# EAGLE design C12880-vertical (EAGLE 7.7.0)
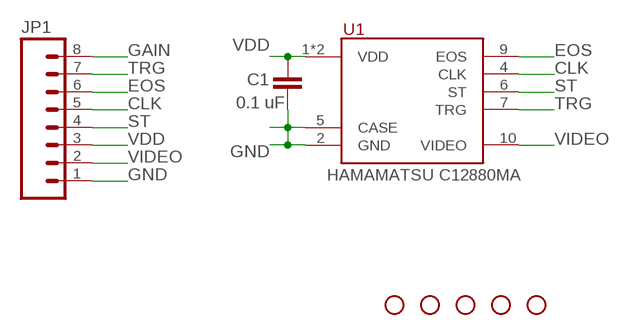
[diagram p0: schematic, sheet 1]

## Parts
C1  0.1 uF  C-EUC0805  [C0805]
JP1  M08SILK_FEMALE_PTH  [1X08]
STANDOFF1  STAND-OFF  [STAND-OFF]
STANDOFF2  STAND-OFF  [STAND-OFF]
STANDOFF3  STAND-OFF  [STAND-OFF]
STANDOFF4  STAND-OFF  [STAND-OFF]
STANDOFF5  STAND-OFF  [STAND-OFF]
U1  MICROSPEC-C12880MA  [C12880MA]

## Nets
CLK: JP1.5 U1.4(CLK)
EOS: JP1.6 U1.9(EOS)
GAIN: JP1.8
GND: C1.2 JP1.1 U1.2(GND) U1.5(CASE)
ST: JP1.4 U1.6(ST)
TRG: JP1.7 U1.7(TRG)
VDD: C1.1 JP1.3 U1.1(VDD) U1.3(VDD)
VIDEO: JP1.2 U1.10(VIDEO)

## Library data of the parts
C1 = Spectron2:C-EU: CAPACITOR, European symbol
JP1 = Spectron2:M08: Header 8 Standard 8-pin 0.1" header. Use with straight break away headers (SKU : PRT-00116), right angle break away headers (PRT-00553), swiss pins (PRT-00743), machine pins (PRT-00117), and female headers (PRT-00115).; PROD_ID: CONN-08438
STANDOFF1-STANDOFF5 = Spectron2:STAND-OFF: #4 Stand Off This is the mechanical footprint for a #4 phillips button head screw. Use the keepout ring to avoid running the screw head into surrounding components. SKU : PRT-00447
U1 = C12880MA:MICROSPEC-C12880MA: Hamamatsu Micro-Spectrometer C12666MA 350-750nm

## Board
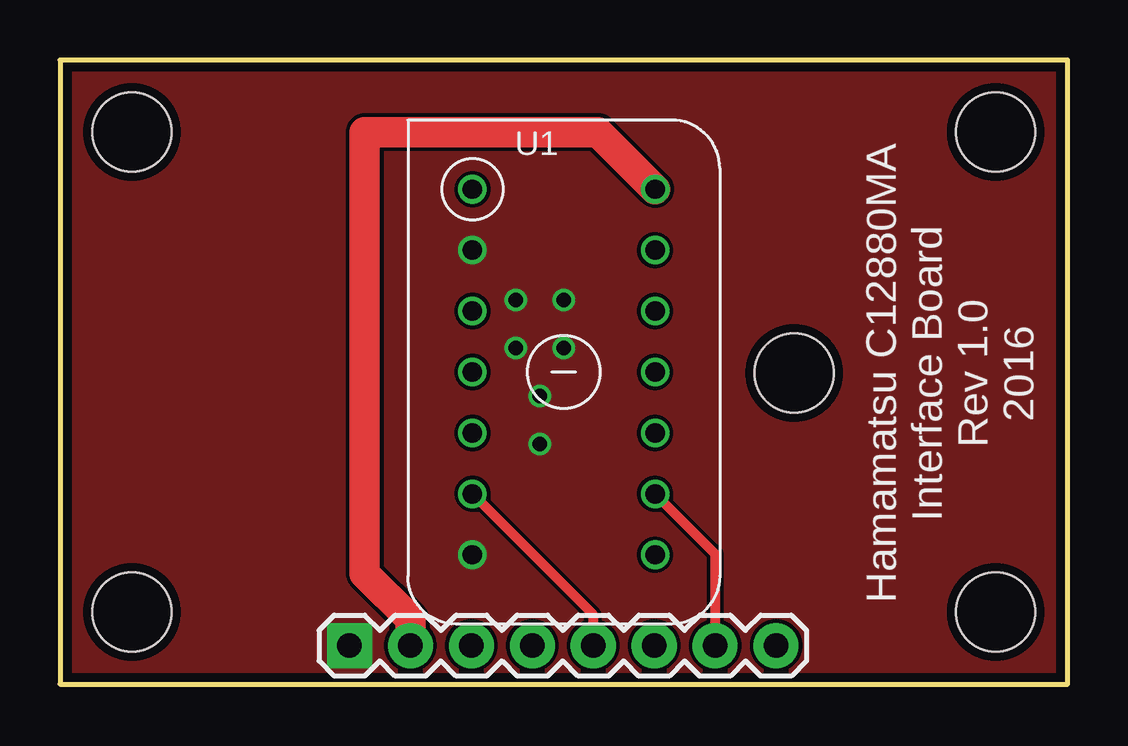
[diagram p1: board, top side]
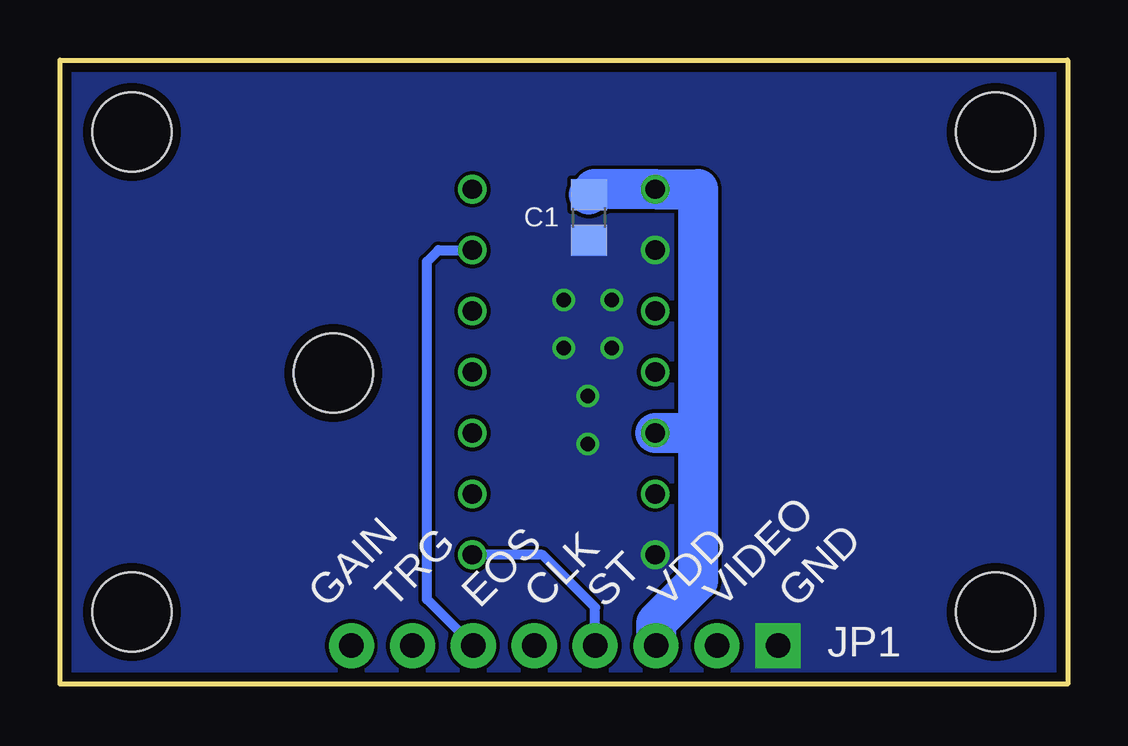
[diagram p2: board, bottom side, seen from below]

Size 42 x 26 mm. Coordinates in mm from the lower left corner, seen from the top.
Outline: 0,0 42,0 42,26 0,26 0,0
Copper layers (1*16): Top 0.0356mm / dielectric 1.5011mm / Bottom 0.0356mm
Design rules "oshpark-2layer": minimum track width 6mil, minimum drill 13mil, track to track 6mil, track to pad 6mil, pad to pad 6mil, via to via 6mil, smd to smd 6mil, copper to edge 15mil, drill to drill 6mil, minimum pad ring 7mil, minimum via ring 7mil, stop-mask expansion 2.5mil, vias tented up to drill 0mil, thermal gap 10mil

### Footprints (pad centres in the part's own frame; a part is rotated, then mirrored left to right if it is on the bottom)
C0805 = smd 1.3 x 1.5: 1 -0.95,0; 2 0.95,0
1X08 = drill 1.016 pad 1.88 square: 1 0,0 | drill 1.016 pad 1.88: 2 2.54,0; 3 5.08,0; 4 7.62,0; 5 10.16,0; 6 12.7,0; 7 15.24,0; 8 17.78,0
STAND-OFF = hole 3.302: 0,0
C12880MA = drill 0.8: 1 -7.62,-3.81; 2 -5.08,-3.81; 3 2.54,-3.81; 4 5.08,-3.81; 5 7.62,-3.81; 6 7.62,3.81; 7 5.08,3.81; 8 2.54,3.81; 9 -5.08,3.81; 10 -7.62,3.81; 11 -2.54,3.81; 12 0,3.81; 13 -2.54,-3.81; 14 0,-3.81

### Placement (x,y rotation side)
C1  19.95,19.44 270 bottom
JP1  12.07,1.6 0 top
STANDOFF1  30.61,12.95 0 top
STANDOFF2  3,3 90 top
STANDOFF3  39,3 0 top
STANDOFF4  39,23 0 top
STANDOFF5  3,23 0 top
U1  21,13 270 top

### Tracks (layer width: path | path; a pad name or v marks a point on that pad's centre or on a via)
CLK
  Top 0.406: JP1.5 22.23,2.88 U1.4
EOS
  Bottom 0.406: JP1.6 26.7,3.53 26.7,17.6 26.22,18.08 U1.9
GND  (via drill 0.6)
  other vias: 19,16 21,16 20,10 20,12 21,14 19,14
  pour Bottom (no thermals): 0.2,25.8 41.8,25.8 41.8,0.2 0.2,0.2
  pour Top (no thermals): 0.2,25.8 41.8,25.8 41.8,0.3 0.2,0.3
ST
  Bottom 0.406: JP1.4 19.69,3.19 21.88,5.38 U1.6
TRG
  Top 0.406: U1.7 27.31,5.42 JP1.7
VDD
  Bottom 1.676: C1.1 19.72,20.62 U1.1 15.4,20.62 15.4,10.46 | U1.3 15.4,10.46 | 15.4,10.46 15.4,4.3 17.15,2.55 JP1.3
VIDEO
  Top 1.27: U1.10 22.43,23 12.7,23 12.7,4.6 14.61,2.69 JP1.2

### Text on the board
tPlace: Hamamatsu C12880MA / Interface Board / Rev 1.0 / 2016
bPlace: GND | VIDEO | VDD | ST | CLK | EOS | TRG | GAIN